# Altium schematic sheet Sheet1.SchDoc
size B
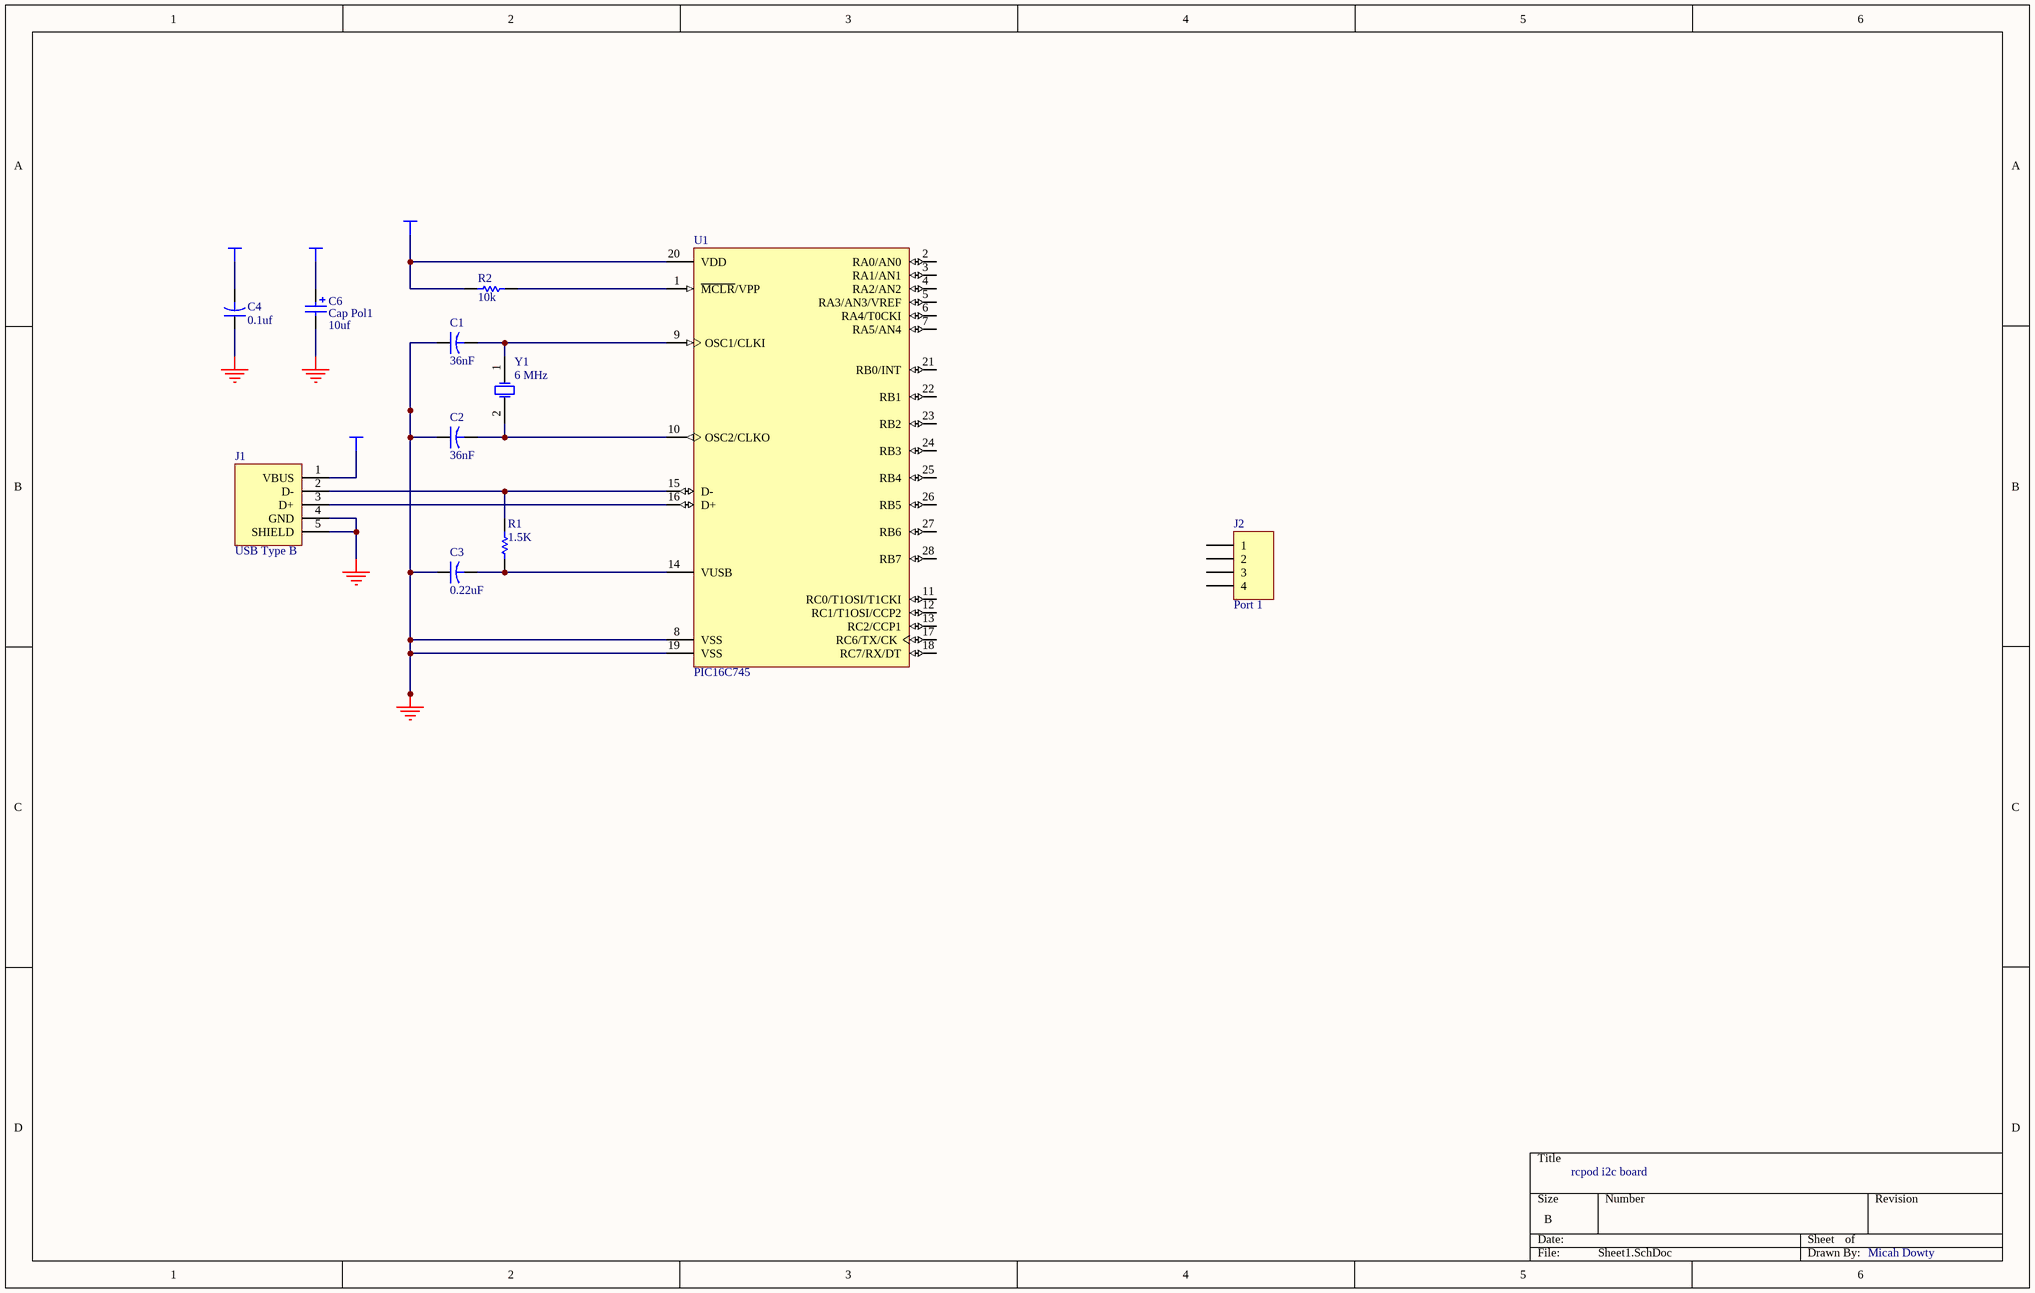
[diagram p0: Sheet1.SchDoc]

## Parts
C1  value 36nF  [CAPR5-4X5]  (hidden comment: Cap2)
C2  value 36nF  [CAPR5-4X5]  (hidden comment: Cap2)
C3  value 0.22uF  [CAPR5-4X5]
C4  value 0.1uf  [CAPR5-4X5]
C6  Cap Pol1  value 10uf  [CAP-EE-1]
J1  USB  [USB-TYPEB]  (value not drawn)
J2  Port 1  [HDR1X4]
R1  value 1.5K  [AXIAL-0.3]  (hidden comment: Res1)
R2  value 10k  [AXIAL-0.3]  (hidden comment: Res1)
U1  (no value)  [DIP-28]
Y1  6 MHz  [BCY-W2/E4.7]

## Nets
GND: C1.1 C2.1 C3.1 C4.1 C6.2 J1.4(GND) J1.5(SHIELD) U1.8(VSS) U1.19(VSS)
VCC: C4.2 C6.1 J1.1(VBUS) R2.2 U1.20(VDD)
NetC1_2: C1.2 U1.9(OSC1/CLKI) Y1.1(OSC1)
NetC2_2: C2.2 U1.10(OSC2/CLKO) Y1.2(OSC2)
NetC3_2: C3.2 R1.1 U1.14(VUSB)
NetJ1_2: J1.2(D-) R1.2 U1.15(D-)
NetJ1_3: J1.3(D+) U1.16(D+)
NetR2_1: R2.1 U1.1(~{MCLR}/VPP)

Not connected (* = marked no-connect by the designer): J2 1 2 3 4; U1 2(RA0/AN0) 3(RA1/AN1) 4(RA2/AN2) 5(RA3/AN3/VREF) 6(RA4/T0CKI) 7(RA5/AN4) 11(RC0/T1OSI/T1CKI) 12(RC1/T1OSI/CCP2) 13(RC2/CCP1) 17(RC6/TX/CK) 18(RC7/RX/DT) 21(RB0/INT) 22(RB1) 23(RB2) 24(RB3) 25(RB4) 26(RB5) 27(RB6) 28(RB7)

## Notes on the sheet
- rcpod i2c board
- Micah Dowty

## Library data of the parts
C1-C4 = Cap2: Capacitor; Manufacturer: Generic Components; Class I: Passive; Published: 23-Sep-2002; Publisher: Altium Limited; Class II: Capacitor
C6 = Cap Pol1: Polarized Capacitor (Radial); Manufacturer: Generic Components; Class I: Passive; Published: 8-Jun-2000; Revision: July-2002: Re-released for DXP Platform.; Publisher: Altium Limited; Class II: Capacitor
J1 = USB Type B: Header, 4-Pin; Manufacturer: Generic Components; Class I: Connector; Revision: July-2002: Re-released for DXP Platform.; Publisher: Altium Limited
J2 = Header 4: Header, 4-Pin; Manufacturer: Generic Components; Class I: Connector; Revision: July-2002: Re-released for DXP Platform.; Publisher: Altium Limited
R1 R2 = Res1: Resistor; Manufacturer: Generic Components; Class I: Passive; Published: 8-Jun-2000; Revision: July-2002: Re-released for DXP Platform.; Publisher: Altium Limited; Class II: Resistor
U1 = PIC16C745: EPROM-Based 8-Bit CMOS Microcontroller with USB; Manufacturer: Microchip; Revision: Modified for PIC16C745 by Micah Dowty; Package Reference: P40; Class I: Microcontroller; Class II: 8-bit
Y1 = XTAL: Crystal Oscillator; Manufacturer: Generic Components; Published: 8-Jun-2000; Revision: July-2002: Re-released for DXP Platform.; Publisher: Altium Limited; Class I: Oscillator; Class II: Crystal Oscillator